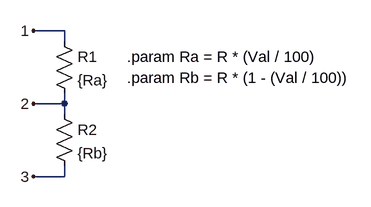
[diagram p0: schematic pot.asc]
pot.asc, the LTspice schematic file:
Version 4
SHEET 1 880 680
WIRE 112 48 64 48
WIRE 112 64 112 48
WIRE 112 160 112 144
WIRE 112 160 64 160
WIRE 112 176 112 160
WIRE 112 272 112 256
WIRE 112 272 64 272
FLAG 64 48 1
FLAG 64 160 2
FLAG 64 272 3
SYMBOL res 96 48 R0
SYMATTR InstName R1
SYMATTR Value {Ra}
SYMBOL res 96 160 R0
SYMATTR InstName R2
SYMATTR Value {Rb}
TEXT 208 88 Left 2 !.param Ra = R * (Val / 100)
TEXT 208 120 Left 2 !.param Rb = R * (1 - (Val / 100))

The netlist it stands for:
* pot.asc
R1 1 2 {Ra}
R2 2 3 {Rb}
.param Ra = R * (Val / 100)
.param Rb = R * (1 - (Val / 100))
.backanno
.end